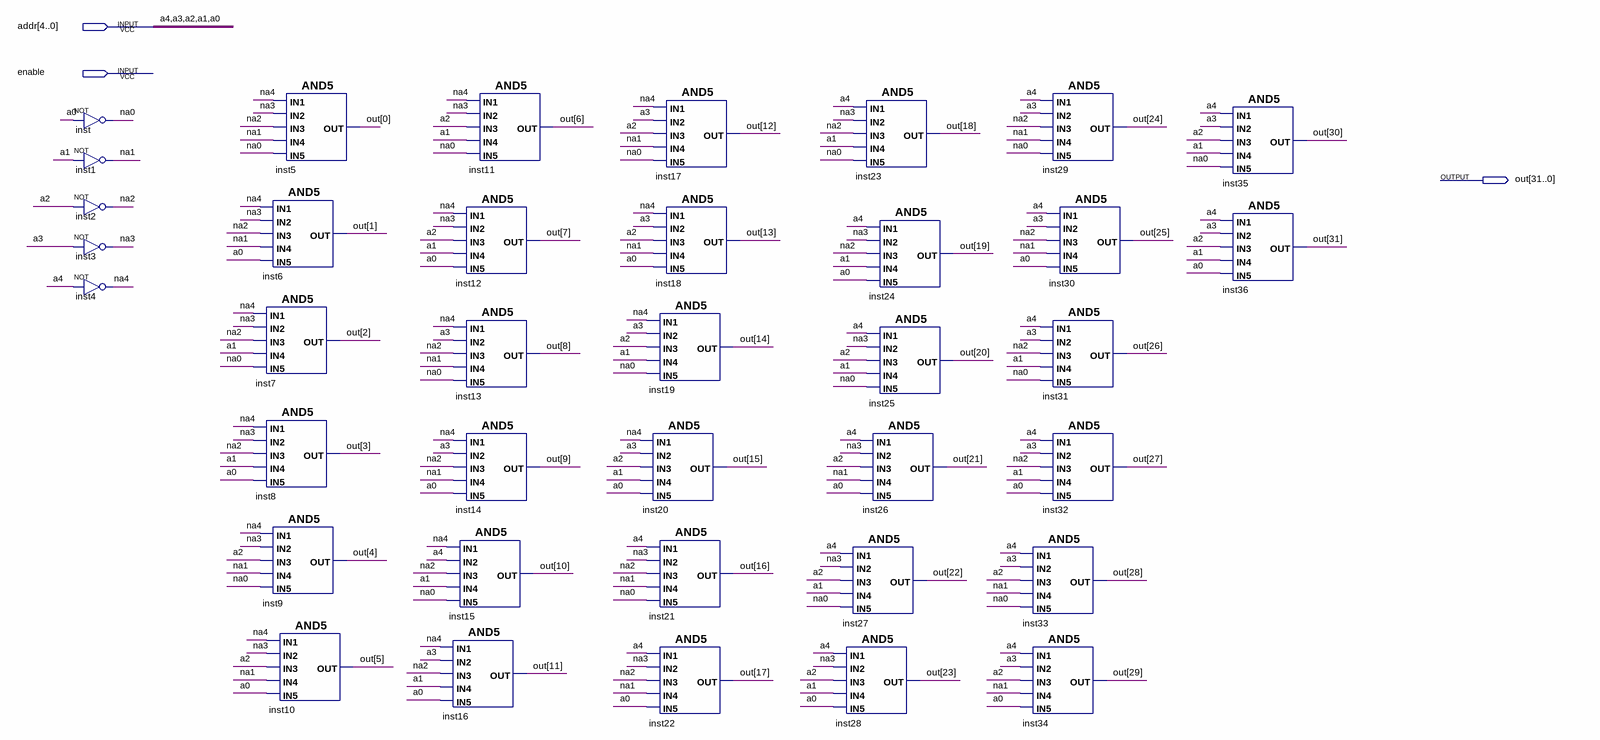
[diagram p0: schematic sheet]
// Quartus schematic dc5.bdf as structural Verilog: 37 symbols, 3 pins
module dc5 (
  input  [4:0] addr,
  input  enable,
  output [31:0] out
);

  wire na0, na1, na2, na3, na4;

  not inst (na0, addr[0]);
  not inst1 (na1, addr[1]);
  not inst2 (na2, addr[2]);
  not inst3 (na3, addr[3]);
  not inst4 (na4, addr[4]);
  and inst5 (out[0], na4, na3, na2, na1, na0);
  and inst6 (out[1], na4, na3, na2, na1, addr[0]);
  and inst7 (out[2], na4, na3, na2, addr[1], na0);
  and inst8 (out[3], na4, na3, na2, addr[1], addr[0]);
  and inst9 (out[4], na4, na3, addr[2], na1, na0);
  and inst10 (out[5], na4, na3, addr[2], na1, addr[0]);
  and inst12 (out[7], na4, na3, addr[2], addr[1], addr[0]);
  and inst13 (out[8], na4, addr[3], na2, na1, na0);
  and inst14 (out[9], na4, addr[3], na2, na1, addr[0]);
  and inst15 (out[10], na4, addr[4], na2, addr[1], na0);
  and inst16 (out[11], na4, addr[3], na2, addr[1], addr[0]);
  and inst11 (out[6], na4, na3, addr[2], addr[1], na0);
  and inst17 (out[12], na4, addr[3], addr[2], na1, na0);
  and inst18 (out[13], na4, addr[3], addr[2], na1, addr[0]);
  and inst19 (out[14], na4, addr[3], addr[2], addr[1], na0);
  and inst20 (out[15], na4, addr[3], addr[2], addr[1], addr[0]);
  and inst21 (out[16], addr[4], na3, na2, na1, na0);
  and inst22 (out[17], addr[4], na3, na2, na1, addr[0]);
  and inst23 (out[18], addr[4], na3, na2, addr[1], na0);
  and inst24 (out[19], addr[4], na3, na2, addr[1], addr[0]);
  and inst25 (out[20], addr[4], na3, addr[2], addr[1], na0);
  and inst26 (out[21], addr[4], na3, addr[2], na1, addr[0]);
  and inst27 (out[22], addr[4], na3, addr[2], addr[1], na0);
  and inst28 (out[23], addr[4], na3, addr[2], addr[1], addr[0]);
  and inst29 (out[24], addr[4], addr[3], na2, na1, na0);
  and inst31 (out[26], addr[4], addr[3], na2, addr[1], na0);
  and inst32 (out[27], addr[4], addr[3], na2, addr[1], addr[0]);
  and inst33 (out[28], addr[4], addr[3], addr[2], na1, na0);
  and inst34 (out[29], addr[4], addr[3], addr[2], na1, addr[0]);
  and inst30 (out[25], addr[4], addr[3], na2, na1, addr[0]);
  and inst35 (out[30], addr[4], addr[3], addr[2], addr[1], na0);
  and inst36 (out[31], addr[4], addr[3], addr[2], addr[1], addr[0]);

  // Other names for the same wires on the sheet: a0 = addr[0]; a1 = addr[1]; a2 = addr[2]; a3 = addr[3]; a4 = addr[4]
endmodule
